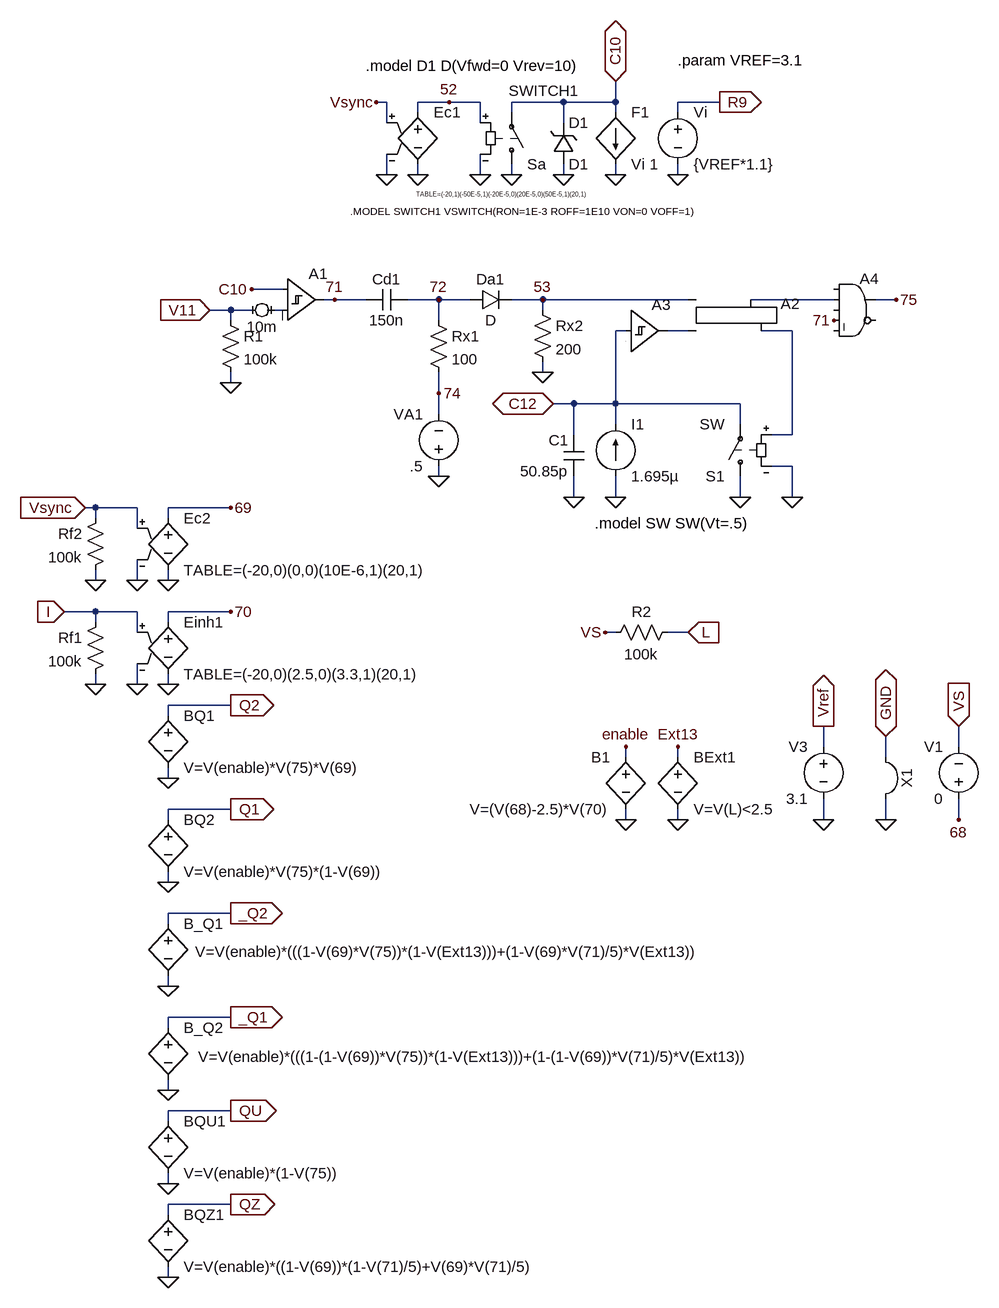
[diagram p0: schematic TCA785.asc]
TCA785.asc, the LTspice schematic file:
Version 4
SHEET 1 2232 1228
WIRE -32 -736 -48 -736
WIRE 64 -736 16 -736
WIRE 112 -736 64 -736
WIRE 240 -736 160 -736
WIRE 320 -736 320 -768
WIRE 320 -736 240 -736
WIRE 480 -736 416 -736
WIRE 16 -720 16 -736
WIRE 160 -720 160 -736
WIRE 320 -720 320 -736
WIRE 416 -720 416 -736
WIRE -32 -704 -32 -736
WIRE 112 -704 112 -736
WIRE 240 -704 240 -736
WIRE -32 -624 -32 -656
WIRE 16 -624 16 -640
WIRE 112 -624 112 -656
WIRE 160 -624 160 -640
WIRE 240 -624 240 -640
WIRE 320 -624 320 -640
WIRE 416 -624 416 -640
WIRE -192 -448 -240 -448
WIRE -112 -432 -128 -432
WIRE -64 -432 -112 -432
WIRE 48 -432 0 -432
WIRE 96 -432 48 -432
WIRE 208 -432 160 -432
WIRE 432 -432 208 -432
WIRE 656 -432 528 -432
WIRE 752 -432 720 -432
WIRE -272 -416 -304 -416
WIRE -240 -416 -272 -416
WIRE -192 -416 -208 -416
WIRE 208 -416 208 -432
WIRE -272 -400 -272 -416
WIRE 48 -400 48 -432
WIRE 336 -384 320 -384
WIRE 432 -384 400 -384
WIRE 592 -384 544 -384
WIRE 208 -320 208 -336
WIRE -272 -304 -272 -320
WIRE 48 -288 48 -320
WIRE 256 -272 224 -272
WIRE 320 -272 320 -384
WIRE 320 -272 256 -272
WIRE 512 -272 320 -272
WIRE 48 -256 48 -288
WIRE 320 -240 320 -272
WIRE 512 -240 512 -272
WIRE 256 -224 256 -272
WIRE 592 -224 592 -384
WIRE 592 -224 560 -224
WIRE 592 -176 560 -176
WIRE 48 -160 48 -176
WIRE 256 -128 256 -160
WIRE 320 -128 320 -160
WIRE 512 -128 512 -160
WIRE 592 -128 592 -176
WIRE -480 -112 -496 -112
WIRE -416 -112 -480 -112
WIRE -272 -112 -368 -112
WIRE -480 -96 -480 -112
WIRE -368 -96 -368 -112
WIRE -416 -80 -416 -112
WIRE -480 0 -480 -16
WIRE -416 0 -416 -32
WIRE -368 0 -368 -16
WIRE -480 48 -528 48
WIRE -416 48 -480 48
WIRE -272 48 -368 48
WIRE -480 64 -480 48
WIRE -368 64 -368 48
WIRE -416 80 -416 48
WIRE 320 80 304 80
WIRE 432 80 400 80
WIRE -480 160 -480 144
WIRE -416 160 -416 128
WIRE -368 160 -368 144
WIRE -272 192 -368 192
WIRE -368 208 -368 192
WIRE 640 256 640 224
WIRE 848 256 848 224
WIRE 336 272 336 256
WIRE 416 272 416 256
WIRE 736 272 736 240
WIRE -368 304 -368 288
WIRE -272 352 -368 352
WIRE -368 368 -368 352
WIRE 336 368 336 352
WIRE 416 368 416 352
WIRE 640 368 640 336
WIRE 736 368 736 336
WIRE 848 368 848 336
WIRE -368 464 -368 448
WIRE -272 512 -368 512
WIRE -368 528 -368 512
WIRE -368 624 -368 608
WIRE -272 672 -368 672
WIRE -368 688 -368 672
WIRE -368 784 -368 768
WIRE -272 816 -368 816
WIRE -368 832 -368 816
WIRE -368 928 -368 912
WIRE -272 960 -368 960
WIRE -368 976 -368 960
WIRE -368 1072 -368 1056
FLAG 320 -624 0
FLAG 160 -624 0
FLAG 112 -624 0
FLAG 16 -624 0
FLAG 320 -768 C10
IOPIN 320 -768 BiDir
FLAG -48 -736 Vsync
FLAG 64 -736 52
FLAG 416 -624 0
FLAG -32 -624 0
FLAG 480 -736 R9
IOPIN 480 -736 Out
FLAG -112 -432 71
FLAG 48 -432 72
FLAG 48 -160 0
FLAG 48 -288 74
FLAG 208 -320 0
FLAG 208 -432 53
FLAG -240 -448 C10
FLAG -304 -416 V11
IOPIN -304 -416 In
FLAG 752 -432 75
FLAG -368 0 0
FLAG -496 -112 Vsync
IOPIN -496 -112 In
FLAG -272 -112 69
FLAG -368 160 0
FLAG -528 48 I
IOPIN -528 48 In
FLAG -272 48 70
FLAG -272 192 Q2
IOPIN -272 192 Out
FLAG 848 224 VS
IOPIN 848 224 In
FLAG 848 368 68
FLAG -272 352 Q1
IOPIN -272 352 Out
FLAG -272 512 _Q2
IOPIN -272 512 Out
FLAG -272 672 _Q1
IOPIN -272 672 Out
FLAG -272 816 QU
IOPIN -272 816 Out
FLAG -272 960 QZ
IOPIN -272 960 Out
FLAG 736 240 GΝD
IOPIN 736 240 BiDir
FLAG 640 224 Vref
IOPIN 640 224 Out
FLAG 320 -128 0
FLAG 512 -128 0
FLAG 592 -128 0
FLAG 256 -128 0
FLAG 224 -272 C12
IOPIN 224 -272 BiDir
FLAG 336 368 0
FLAG 336 256 enable
FLAG 656 -400 71
FLAG 416 368 0
FLAG 416 256 Ext13
FLAG -272 -304 0
FLAG 304 80 VS
FLAG 432 80 L
IOPIN 432 80 In
FLAG -368 304 0
FLAG -368 464 0
FLAG -368 624 0
FLAG -368 784 0
FLAG -368 928 0
FLAG -368 1072 0
FLAG 640 368 0
FLAG -480 160 0
FLAG -416 160 0
FLAG -416 0 0
FLAG -480 0 0
FLAG 240 -624 0
FLAG 736 368 0
SYMBOL sw 160 -624 M180
WINDOW 3 -4 129 Left 2
SYMATTR Value SWITCH1
SYMATTR InstName Sa
SYMBOL f 320 -720 R0
SYMATTR InstName F1
SYMATTR Value Vi 1
SYMBOL voltage 416 -736 R0
SYMATTR InstName Vi
SYMATTR Value {VREF*1.1}
SYMBOL e 16 -736 R0
WINDOW 3 -3 142 Left 0
SYMATTR Value TABLE=(-20,1)(-50E-5,1)(-20E-5,0)(20E-5,0)(50E-5,1)(20,1)
SYMATTR InstName Ec1
SYMBOL cap 0 -448 R90
WINDOW 0 0 32 VBottom 2
WINDOW 3 32 32 VTop 2
SYMATTR InstName Cd1
SYMATTR Value 150n
SYMBOL diode 96 -416 R270
WINDOW 0 32 32 VTop 2
WINDOW 3 0 32 VBottom 2
SYMATTR InstName Da1
SYMBOL res 32 -416 R0
SYMATTR InstName Rx1
SYMATTR Value 100
SYMBOL voltage 48 -160 R180
WINDOW 0 24 96 Left 2
WINDOW 3 24 16 Left 2
SYMATTR InstName VA1
SYMATTR Value .5
SYMBOL res 192 -432 R0
SYMATTR InstName Rx2
SYMATTR Value 200
SYMBOL e -368 -112 R0
SYMATTR InstName Ec2
SYMATTR Value TABLE=(-20,0)(0,0)(10E-6,1)(20,1)
SYMBOL e -368 48 R0
SYMATTR InstName Einh1
SYMATTR Value TABLE=(-20,0)(2.5,0)(3.3,1)(20,1)
SYMBOL bv -368 192 R0
SYMATTR InstName BQ1
SYMATTR Value V=V(enable)*V(75)*V(69)
SYMBOL voltage 848 352 R180
WINDOW 0 24 96 Left 2
WINDOW 3 24 16 Left 2
SYMATTR InstName V1
SYMATTR Value 0
SYMBOL res -464 48 M0
SYMATTR InstName Rf1
SYMATTR Value 100k
SYMBOL res -464 -112 M0
SYMATTR InstName Rf2
SYMATTR Value 100k
SYMBOL bv -368 352 R0
SYMATTR InstName BQ2
SYMATTR Value V=V(enable)*V(75)*(1-V(69))
SYMBOL bv -368 512 R0
WINDOW 3 41 59 Left 2
SYMATTR Value V=V(enable)*(((1-V(69)*V(75))*(1-V(Ext13)))+(1-V(69)*V(71)/5)*V(Ext13))
SYMATTR InstName B_Q1
SYMBOL bv -368 672 R0
WINDOW 3 46 61 Left 2
SYMATTR Value V=V(enable)*(((1-(1-V(69))*V(75))*(1-V(Ext13)))+(1-(1-V(69))*V(71)/5)*V(Ext13))
SYMATTR InstName B_Q2
SYMBOL bv -368 816 R0
SYMATTR InstName BQU1
SYMATTR Value V=V(enable)*(1-V(75))
SYMBOL bv -368 960 R0
SYMATTR InstName BQZ1
SYMATTR Value V=V(enable)*((1-V(69))*(1-V(71)/5)+V(69)*V(71)/5)
SYMBOL voltage 640 240 M0
SYMATTR InstName V3
SYMATTR Value 3.1
SYMBOL Digital\\diffschmtbuf -192 -496 R0
WINDOW 3 8 120 Invisible 2
SYMATTR Value VHIGH=5 VT=0 VH=0
SYMATTR InstName A1
SYMBOL current 320 -160 M180
WINDOW 0 24 80 Left 2
WINDOW 3 24 0 Left 2
SYMATTR InstName I1
SYMATTR Value 1.695µ
SYMBOL sw 512 -144 R180
SYMATTR InstName S1
SYMBOL Digital\\srflop 480 -480 R0
WINDOW 3 -40 28 Invisible 2
SYMATTR Value Td=50n
SYMATTR InstName A2
SYMBOL Digital\\schmtbuf 336 -448 R0
WINDOW 3 8 60 Invisible 2
SYMATTR Value VT=1 VH=0
SYMATTR InstName A3
SYMBOL cap 272 -224 M0
SYMATTR InstName C1
SYMATTR Value 50.85p
SYMBOL bv 336 256 M0
SYMATTR InstName B1
SYMATTR Value V=(V(68)-2.5)*V(70)
SYMBOL Digital\\and 688 -480 R0
SYMATTR InstName A4
SYMBOL bv 416 256 R0
SYMATTR InstName BExt1
SYMATTR Value V=V(L)<2.5
SYMBOL res -288 -416 R0
SYMATTR InstName R1
SYMATTR Value 100k
SYMBOL res 304 96 R270
WINDOW 0 32 56 VTop 2
WINDOW 3 -2 56 VBottom 2
SYMATTR InstName R2
SYMATTR Value 100k
SYMBOL Misc\\jumper 800 304 R90
SYMATTR InstName X1
SYMBOL zener 224 -640 M180
WINDOW 0 24 64 Left 2
WINDOW 3 24 0 Left 2
SYMATTR InstName D1
SYMATTR Value D1
SYMBOL zMiniSyms4\\voltage- -224 -416 R90
WINDOW 0 -10 0 Invisible 2
WINDOW 3 10 0 VTop 2
SYMATTR InstName V2
SYMATTR Value 10m
TEXT -88 -568 Left 1 !.MODEL SWITCH1 VSWITCH(RON=1E-3 ROFF=1E10 VON=0 VOFF=1)
TEXT 288 -88 Left 2 !.model SW SW(Vt=.5)
TEXT 416 -800 Left 2 !.param VREF=3.1
TEXT -64 -792 Left 2 !.model D1 D(Vfwd=0 Vrev=10)

The netlist it stands for:
* TCA785.asc
Sa 0 C10 52 0 SWITCH1
F1 C10 0 Vi 1
Vi R9 0 {VREF*1.1}
Ec1 52 0 Vsync 0 TABLE=(-20,1)(-50E-5,1)(-20E-5,0)(20E-5,0)(50E-5,1)(20,1)
Cd1 72 71 150n
Da1 72 53 D
Rx1 72 74 100
VA1 0 74 .5
Rx2 53 0 200
Ec2 69 0 Vsync 0 TABLE=(-20,0)(0,0)(10E-6,1)(20,1)
Einh1 70 0 I 0 TABLE=(-20,0)(2.5,0)(3.3,1)(20,1)
BQ1 Q2 0 V=V(enable)*V(75)*V(69)
V1 68 VS 0
Rf1 I 0 100k
Rf2 Vsync 0 100k
BQ2 Q1 0 V=V(enable)*V(75)*(1-V(69))
B_Q1 _Q2 0 V=V(enable)*(((1-V(69)*V(75))*(1-V(Ext13)))+(1-V(69)*V(71)/5)*V(Ext13))
B_Q2 _Q1 0 V=V(enable)*(((1-(1-V(69))*V(75))*(1-V(Ext13)))+(1-(1-V(69))*V(71)/5)*V(Ext13))
BQU1 QU 0 V=V(enable)*(1-V(75))
BQZ1 QZ 0 V=V(enable)*((1-V(69))*(1-V(71)/5)+V(69)*V(71)/5)
V3 Vref 0 3.1
A1 C10 N002 0 0 0 0 71 0 SCHMITT VHIGH=5 VT=0 VH=0
I1 0 C12 1.695µ
S1 0 C12 N004 0 SW
A2 53 N003 0 0 0 N004 N001 0 SRFLOP Td=50n
A3 C12 0 0 0 0 0 N003 0 SCHMITT VT=1 VH=0
C1 C12 0 50.85p
B1 enable 0 V=(V(68)-2.5)*V(70)
A4 0 N001 0 71 0 0 75 0 AND
BExt1 Ext13 0 V=V(L)<2.5
R1 V11 0 100k
R2 VS L 100k
D1 0 C10 D1
V2 N002 V11 10m
.model D D
.lib standard.dio
.MODEL SWITCH1 VSWITCH(RON=1E-3 ROFF=1E10 VON=0 VOFF=1)
.model SW SW(Vt=.5)
.param VREF=3.1
.model D1 D(Vfwd=0 Vrev=10)
.backanno
.end